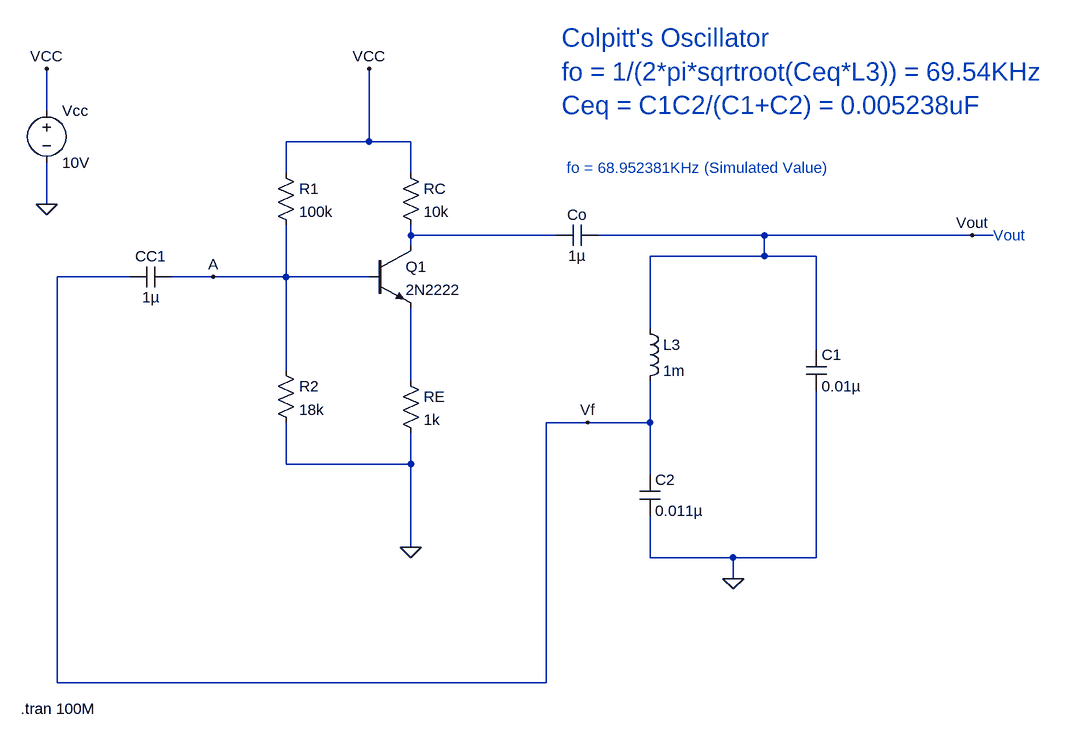
[diagram p0: schematic Colpitts_Oscillator.asc]
Colpitts_Oscillator.asc, the LTspice schematic file:
Version 4
SHEET 1 1412 952
WIRE -240 16 -240 -48
WIRE 256 64 256 -48
WIRE 256 64 128 64
WIRE 320 64 256 64
WIRE 128 112 128 64
WIRE 320 112 320 64
WIRE -240 160 -240 96
WIRE 320 208 320 192
WIRE 544 208 320 208
WIRE 864 208 608 208
WIRE 1184 208 864 208
WIRE 1216 208 1184 208
WIRE 320 224 320 208
WIRE 864 240 864 208
WIRE 864 240 688 240
WIRE 944 240 864 240
WIRE -112 272 -224 272
WIRE 16 272 -48 272
WIRE 128 272 128 192
WIRE 128 272 16 272
WIRE 256 272 128 272
WIRE 688 352 688 240
WIRE 944 384 944 240
WIRE 128 416 128 272
WIRE 320 432 320 320
WIRE 592 496 528 496
WIRE 688 496 688 432
WIRE 688 496 592 496
WIRE 128 560 128 496
WIRE 320 560 320 512
WIRE 320 560 128 560
WIRE 688 576 688 496
WIRE 320 688 320 560
WIRE 688 704 688 640
WIRE 816 704 688 704
WIRE 944 704 944 448
WIRE 944 704 816 704
WIRE 816 736 816 704
WIRE -224 896 -224 272
WIRE 528 896 528 496
WIRE 528 896 -224 896
FLAG 816 736 0
FLAG 320 688 0
FLAG 16 272 A
FLAG 592 496 Vf
FLAG 1184 208 Vout
FLAG -240 160 0
FLAG 256 -48 VCC
FLAG -240 -48 VCC
SYMBOL voltage -240 0 R0
WINDOW 123 0 0 Left 0
WINDOW 39 0 0 Left 0
SYMATTR InstName Vcc
SYMATTR Value 10V
SYMBOL res 112 96 R0
SYMATTR InstName R1
SYMATTR Value 100k
SYMBOL res 112 400 R0
SYMATTR InstName R2
SYMATTR Value 18k
SYMBOL res 304 416 R0
SYMATTR InstName RE
SYMATTR Value 1k
SYMBOL cap -112 288 R270
WINDOW 0 32 32 VTop 2
WINDOW 3 0 32 VBottom 2
SYMATTR InstName CC1
SYMATTR Value 1µ
SYMBOL cap 544 224 R270
WINDOW 0 32 32 VTop 2
WINDOW 3 0 32 VBottom 2
SYMATTR InstName Co
SYMATTR Value 1µ
SYMBOL res 304 96 R0
SYMATTR InstName RC
SYMATTR Value 10k
SYMBOL npn 256 224 R0
SYMATTR InstName Q1
SYMATTR Value 2N2222
SYMBOL cap 928 384 R0
SYMATTR InstName C1
SYMATTR Value 0.01µ
SYMBOL ind 672 336 R0
SYMATTR InstName L3
SYMATTR Value 1m
SYMBOL cap 672 576 R0
SYMATTR InstName C2
SYMATTR Value 0.011µ
TEXT 1216 208 Left 2 ;Vout
TEXT 552 -96 Left 4 ;Colpitt's Oscillator\nfo = 1/(2*pi*sqrtroot(Ceq*L3)) = 69.54KHz\nCeq = C1C2/(C1+C2) = 0.005238uF
TEXT -280 936 Left 2 !.tran 100M
TEXT 560 104 Left 2 ;fo = 68.952381KHz (Simulated Value)

The netlist it stands for:
* Colpitts_Oscillator.asc
Vcc VCC 0 10V
R1 VCC A 100k
R2 A 0 18k
RE N002 0 1k
CC1 Vf A 1µ
Co N001 Vout 1µ
RC VCC N001 10k
Q1 N001 A N002 0 2N2222
C1 Vout 0 0.01µ
L3 Vout Vf 1m
C2 Vf 0 0.011µ
.model NPN NPN
.model PNP PNP
.lib standard.bjt
* Vout
* Colpitt's Oscillator
* fo = 1/(2*pi*sqrtroot(Ceq*L3)) = 69.54KHz
* Ceq = C1C2/(C1+C2) = 0.005238uF
.tran 100M
* fo = 68.952381KHz (Simulated Value)
.backanno
.end